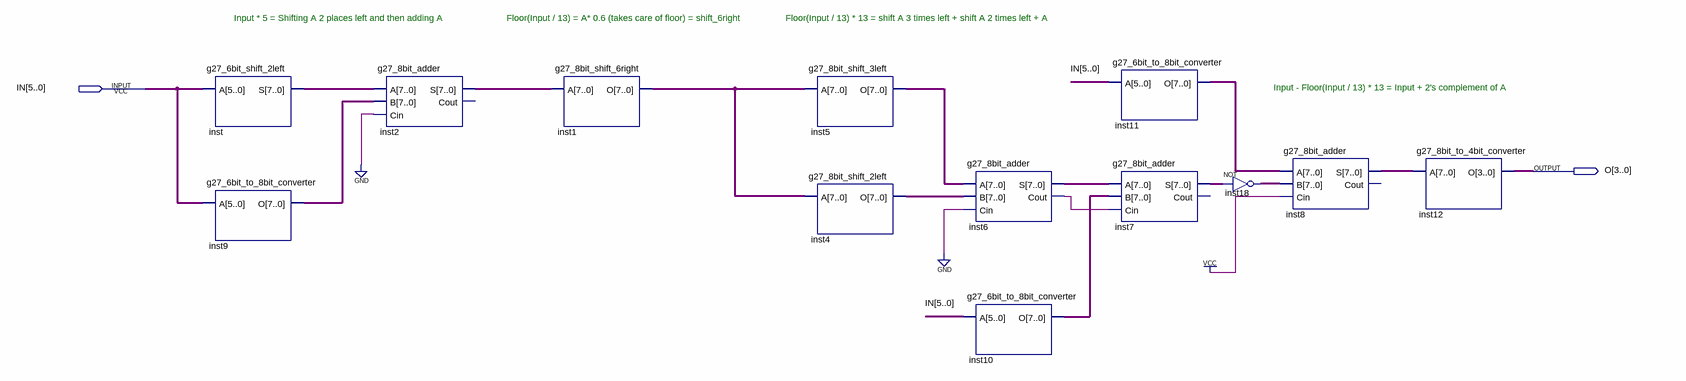
[diagram p0: schematic sheet]
// Quartus schematic g27_Modulo_13.bdf as structural Verilog: 13 symbols, 2 pins
module g27_Modulo_13 (
  input  [5:0] IN,
  output [3:0] O
);

  wire inst6_cout;
  wire [7:0] inst1_o, inst2_s, inst4_o, inst5_o, inst6_s, inst7_s, inst8_s, inst9_o, inst10_o, inst11_o,
       inst18_out, inst_s;

  g27_6bit_shift_2left inst (.A(IN), .S(inst_s));
  g27_6bit_to_8bit_converter inst9 (.A(IN), .O(inst9_o));
  g27_8bit_adder inst2 (.A(inst_s), .B(inst9_o), .Cin(1'b0), .S(inst2_s));  // open: Cout
  g27_8bit_shift_6right inst1 (.A(inst2_s), .O(inst1_o));
  g27_8bit_shift_3left inst5 (.A(inst1_o), .O(inst5_o));
  g27_8bit_shift_2left inst4 (.A(inst1_o), .O(inst4_o));
  g27_8bit_adder inst6 (.A(inst5_o), .B(inst4_o), .Cin(1'b0), .S(inst6_s), .Cout(inst6_cout));
  g27_6bit_to_8bit_converter inst10 (.A(IN), .O(inst10_o));
  g27_6bit_to_8bit_converter inst11 (.A(IN), .O(inst11_o));
  g27_8bit_adder inst7 (.A(inst6_s), .B(inst10_o), .Cin(inst6_cout), .S(inst7_s));  // open: Cout
  assign inst18_out = ~inst7_s;  // NOT inst18, 8 bits wide
  g27_8bit_adder inst8 (.A(inst11_o), .B(inst18_out), .Cin(1'b1), .S(inst8_s));  // open: Cout
  g27_8bit_to_4bit_converter inst12 (.A(inst8_s), .O(O));

  // Notes on the sheet:
  //   Input * 5 = Shifting A 2 places left and then adding A
  //   Floor(Input / 13) = A* 0.6 (takes care of floor) = shift_6right 
  //   Floor(Input / 13) * 13 = shift A 3 times left + shift A 2 times left + A
  //   Input - Floor(Input / 13) * 13 = Input + 2's complement of A
endmodule
